# Altium schematic sheet MainBoard_MCU_Power.SchDoc
size B
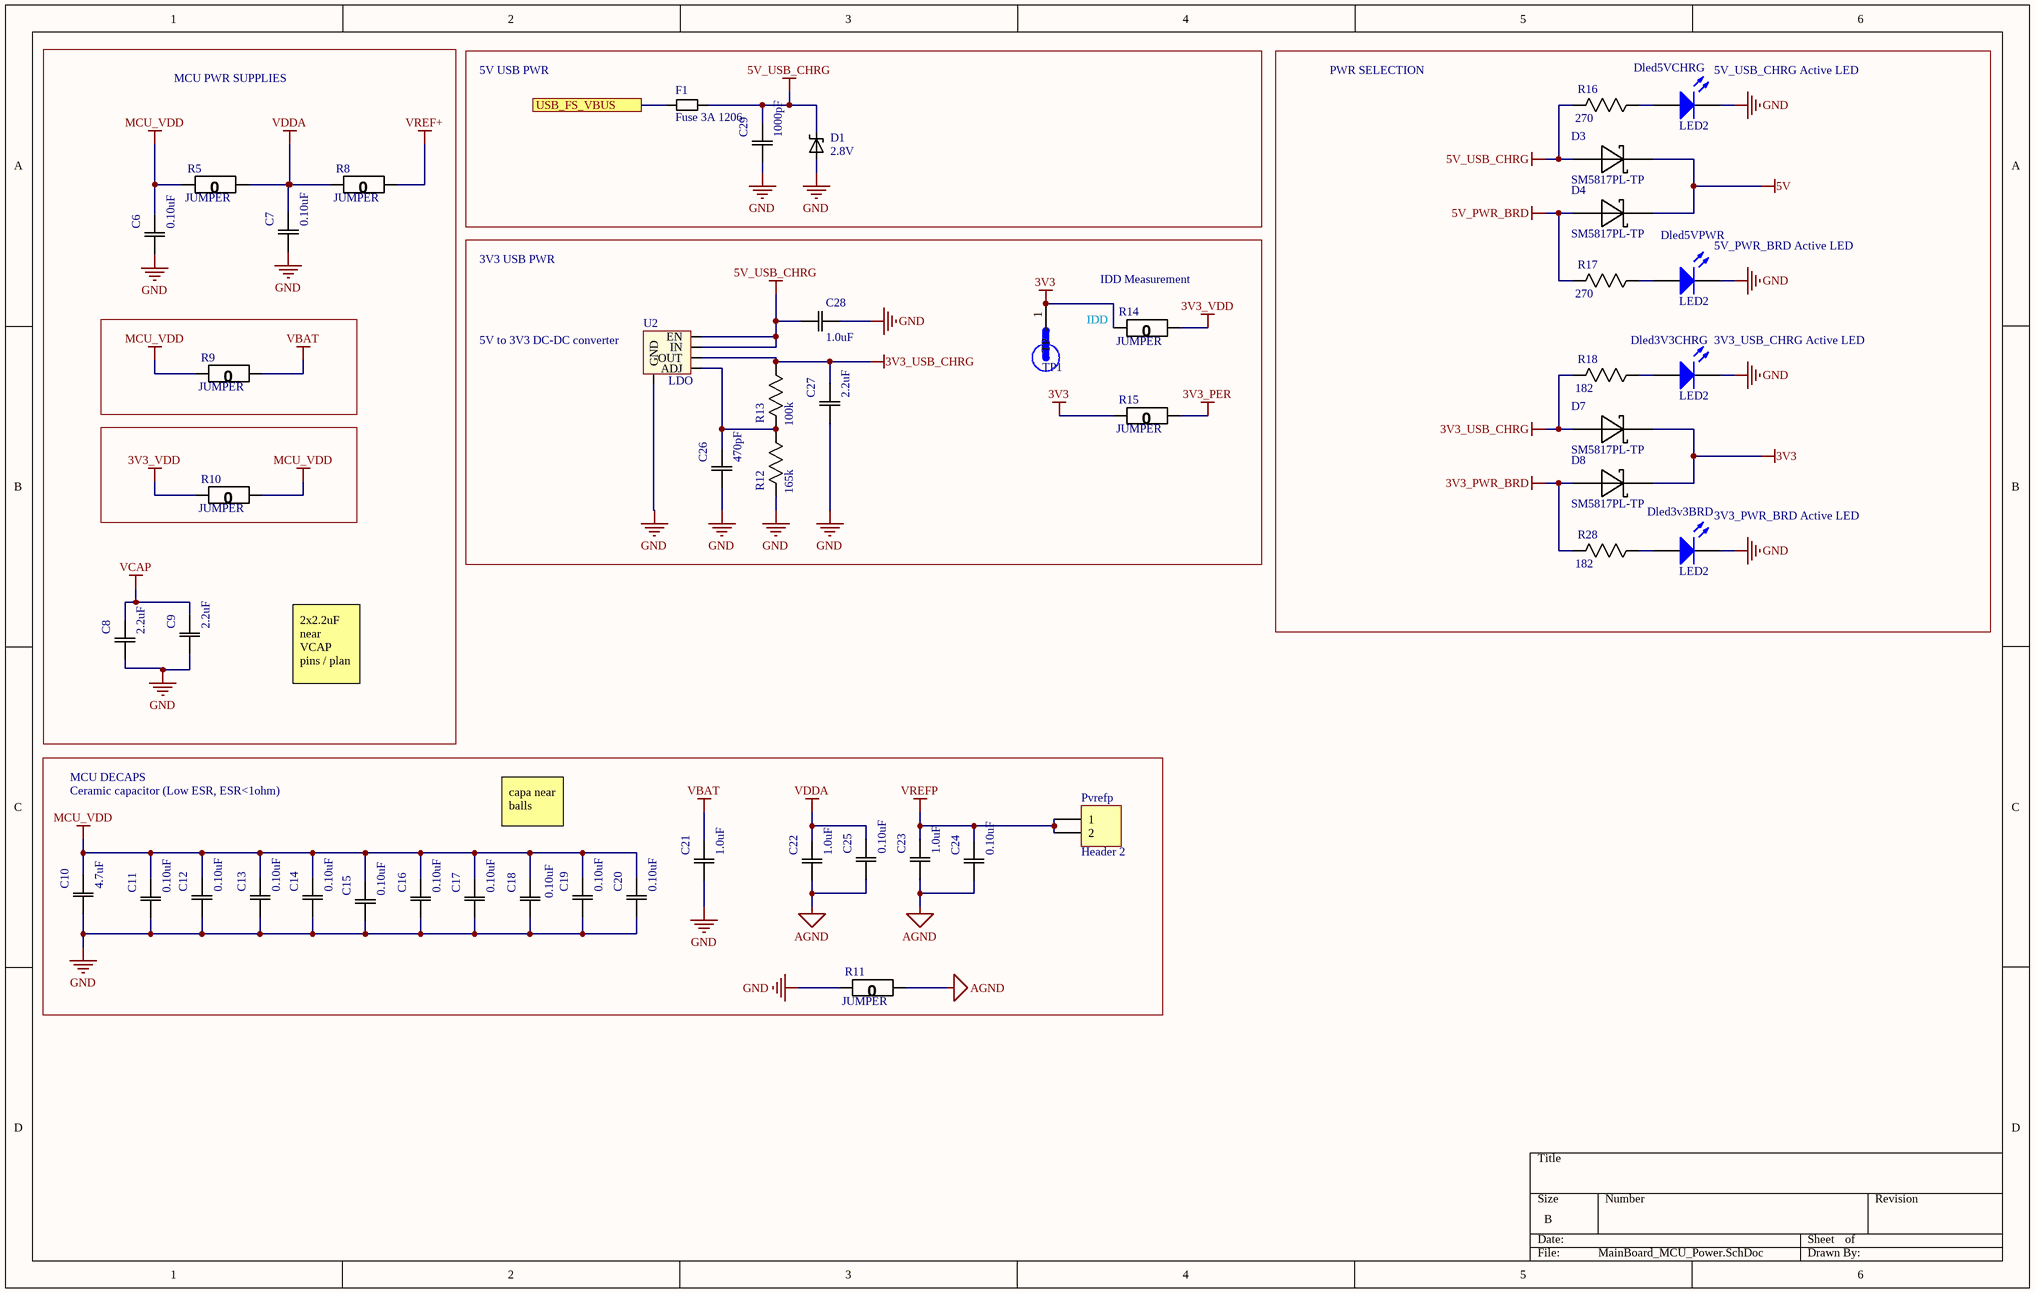
[diagram p0: MainBoard_MCU_Power.SchDoc]

## Parts
C6  0.10uF  [0603]
C7  0.10uF  [0603]
C8  2.2uF  [0603]
C9  2.2uF  [0603]
C10  4.7uF  [0603]
C11  0.10uF  [0603]
C12  0.10uF  [0603]
C13  0.10uF  [0603]
C14  0.10uF  [0603]
C15  0.10uF  [0603]
C16  0.10uF  [0603]
C17  0.10uF  [0603]
C18  0.10uF  [0603]
C19  0.10uF  [0603]
C20  0.10uF  [0603]
C21  1.0uF  [0603]
C22  1.0uF  [0603]
C23  1.0uF  [0603]
C24  0.10uF  [0603]
C25  0.10uF  [0603]
C26  470pF  [0603]
C27  2.2uF  [0603]
C28  1.0uF  [0603]
C29  1000pF  [0603]
D1  2.8V  [SOD-123]
D3  SM5817PL-TP  [SOD-123]
D4  SM5817PL-TP  [SOD-123]
D7  SM5817PL-TP  [SOD-123]
D8  SM5817PL-TP  [SOD-123]
Dled3v3BRD  LED2  [3.2X1.6X1.1]
Dled3V3CHRG  LED2  [3.2X1.6X1.1]
Dled5VCHRG  LED2  [3.2X1.6X1.1]
Dled5VPWR  LED2  [3.2X1.6X1.1]
F1  Fuse 3A 1206  [1206]
Pvrefp  Header 2  [HDR1X2]
R5  JUMPER  [0805]
R8  JUMPER  [0805]
R9  JUMPER  [0805]
R10  JUMPER  [0805]
R11  JUMPER  [0805]
R12  165k  [0805]
R13  100k  [0805]
R14  JUMPER  [0805]
R15  JUMPER  [0805]
R16  270  [0805]
R17  270  [0805]
R18  182  [0805]
R28  182  [0805]
TP1  Test Point - 5019  [TP380X203]  (value not drawn)
U2  LDO  [REG LIN POS ADJ 500MA 8SOIC]

## Blocks framed on the sheet
MCU PWR SUPPLIES: C6-C9 R5 R8-R10
5V USB PWR: C29 D1 F1

## Ports
USB_FS_VBUS

## Nets
3V3: D7.C(K) D8.C(K) R14.2(R2) R15.2(R2) TP1.1(TP)
3V3_PER: R15.1(R1)
3V3_PWR_BRD: D8.A R28.2(R2)
3V3_USB_CHRG: C27.2(C2) D7.A R13.1(R1) R18.2(R2) U2.OUT
3V3_VDD: R10.2(R2) R14.1(R1)
5V: D3.C(K) D4.C(K)
5V_PWR_BRD: D4.A R17.2(R2)
5V_USB_CHRG: C28.1(C1) C29.2(C2) D1.C D3.A F1.2 R16.2(R2) U2.EN U2.IN
AGND: C22.1(C1) C23.1(C1) C24.1(C1) C25.1(C1) R11.1(R1)
GND: C6.1(C1) C7.1(C1) C8.1(C1) C9.1(C1) C10.1(C1) C11.1(C1) C12.1(C1) C13.1(C1) C14.1(C1) C15.1(C1) C16.1(C1) C17.1(C1) C18.1(C1) C19.1(C1) C20.1(C1) C21.1(C1) C26.1(C1) C27.1(C1) C28.2(C2) C29.1(C1) D1.A Dled3v3BRD.2(K) Dled3V3CHRG.2(K) Dled5VCHRG.2(K) Dled5VPWR.2(K) R11.2(R2) R12.2(R2) U2.GND
MCU_VDD: C6.2(C2) C10.2(C2) C11.2(C2) C12.2(C2) C13.2(C2) C14.2(C2) C15.2(C2) C16.2(C2) C17.2(C2) C18.2(C2) C19.2(C2) C20.2(C2) R5.2(R2) R9.2(R2) R10.1(R1)
VBAT: C21.2(C2) R9.1(R1)
VCAP: C8.2(C2) C9.2(C2)
VDDA: C7.2(C2) C22.2(C2) C25.2(C2) R5.1(R1) R8.2(R2)
VREF+: R8.1(R1)
VREFP: C23.2(C2) C24.2(C2) Pvrefp.1 Pvrefp.2
USB_FS_VBUS: F1.1 ; port USB_FS_VBUS
NetC26_2: C26.2(C2) R12.1(R1) R13.2(R2) U2.ADJ
NetDled3v3BRD_1: Dled3v3BRD.1(A) R28.1(R1)
NetDled3V3CHRG_1: Dled3V3CHRG.1(A) R18.1(R1)
NetDled5VCHRG_1: Dled5VCHRG.1(A) R16.1(R1)
NetDled5VPWR_1: Dled5VPWR.1(A) R17.1(R1)

## Notes on the sheet
- PWR SELECTION
- (near Dled5VCHRG) 5V_USB_CHRG Active LED
- 3V3 USB PWR
- (near R14) IDD Measurement
- (near Dled5VPWR) 5V_PWR_BRD Active LED
- (near U2) 5V to 3V3 DC-DC converter
- (near R14) IDD
- (near Dled3V3CHRG) 3V3_USB_CHRG Active LED
- (near Dled3v3BRD) 3V3_PWR_BRD Active LED
- 2x2.2uF near VCAP pins / plan
- MCU DECAPS
- Ceramic capacitor (Low ESR, ESR<1ohm)
- capa near balls

## Library data of the parts
C6 C7 C11-C20 C24 C25 = CAP 0.10uF 16V: CAP CER 0.10UF 16V X5R 0603/0805; Tolerance: 10%; Package: 0603/0805; Value: 0.10uF; Rating: 16V; Temperature Coefficient: X5R; Operating Temperature: -55°C ~ 85°C
C8 C9 C27 = CAP 2.2uF 16V: CAP CER 2.2UF 16V X5R 0603/0805; Tolerance: 10%; Package: 0603/0805; Value: 2.2uF; Rating: 16V; Temperature Coefficient: X5R; Operating Temperature: -55°C ~ 85°C
C10 = CAP 4.7uF 16V: CAP CER 4.7UF 16V X5R 0603/0805; Tolerance: 10%; Package: 0603/0805; Value: 4.7uF; Rating: 16V; Temperature Coefficient: X5R; Operating Temperature: -55°C ~ 85°C
C21-C23 C28 = CAP 1.0uF 16V: CAP CER 1.0UF 16V X5R 0603/0805; Tolerance: 10%; Package: 0603/0805; Value: 1.0uF; Rating: 16V; Temperature Coefficient: X5R; Operating Temperature: -55°C ~ 85°C
C26 = CAP 470pF 16V: CAP CER 470PF 16V X5R 0603/0805; Tolerance: 10%; Package: 0603/0805; Value: 470pF; Rating: 16V; Temperature Coefficient: X5R; Operating Temperature: -55°C ~ 85°C
C29 = CAP 1000pF 16V: CAP CER 1000PF 16V X5R 0603/0805; Tolerance: 10%; Package: 0603/0805; Value: 1000pF; Rating: 16V; Temperature Coefficient: X5R; Operating Temperature: -55°C ~ 85°C
D1 = DIODE ZENER 2.8V 500mW: Zener Diode 2.8V 500mW ±5% Surface Mount SOD-123; Impedance (Max) (Zzt): 30 Ohms; Current - Reverse Leakage @ Vr: 75µA @ 1V; Voltage - Forward (Vf) (Max) @ If: 900mV @ 10mA; ComponentLink1Description: digikey; ComponentLink1URL: https://www.digikey.ca/en/products/detail/micro-commercial-co/MMSZ5245B-TP/1793206; Power - Max: 500mW; Voltage - Zener (Nom) (Vz): 2.8V
D3 D4 D7 D8 = DIODE SCHOTTKY 20V 1A: Diode Schottky 20V 1A Surface Mount SOD-123FL; MF: Micro Commercial Co; ComponentLink1Description: digikey; ComponentLink1URL: https://www.digikey.ca/product-detail/en/on-semiconductor/MBR0540T1G/MBR0540T1GOSCT-ND/917967; Digikey: SM5817PL-TPMSCT-ND; Digikey Link: https://www.digikey.ca/product-detail/en/micro-commercial-co/SM5817PL-TP/SM5817PL-TPMSCT-ND/1793410; MP: SM5817PL-TP; Voltage Rating: 20V; Package: SOD-123; Current Rating: 1A
Dled3v3BRD Dled3V3CHRG Dled5VCHRG Dled5VPWR = LED GREEN SMD: Typical RED, GREEN, YELLOW, AMBER GaAs LED; Voltage - Forward (Vf) (Typ): 2V; Lens Transparency: Clear; Current - Test: 20mA; Package: 1206; Color: Green
F1 = FUSE 3A 63V SLOW: FUSE 3A 63V AC/DC SLOW 1206; Response Time: Slow Blow; Current Rating (Amps): 3A; Operating Temperature: -55°C ~ 90°C; Voltage Rating - AC: 63V; Voltage Rating - DC: 63V
Pvrefp = Header 2: Header, 2-Pin; LatestRevisionDate: 17-Jul-2002; LatestRevisionNote: Re-released for DXP Platform.; Publisher: Altium Limited
R5 R8-R11 R14 R15 = RES 0 JUMPER: RES SMD 0 OHM JUMPER GENERIC 0805; Value: 0; Package: 0805
R12 = RES 165k 1/4W: RES SMD 165K OHM 1% 1/4W 0805; Power (Watts): 0.25W; Package: 0805; Value: 165k; Tolerance: 1%
R13 = RES 100k 1/8W - 1%: RES SMD 100K OHM 1% 1/8W 0805; Power (Watts): 0.125W; Package: 0805; Value: 100k; Tolerance: 1%
R16 R17 = RES 270.0 1/8W: RES SMD 270 OHM 5% 1/8W 0805; Power (Watts): 0.125W; Package: 0805; Value: 270; Tolerance: 5%
R18 R28 = RES 182.0 1/8W: RES SMD 182 OHM 1% 1/8W 0805; Power (Watts): 0.125W; Package: 0805; Value: 182; Tolerance: 1%
TP1 = Test Point - 5019: PC Test Point, Miniature Phosphor Bronze, Silver Plating Surface Mount Mounting Type; MP: 5019; MF: Keystone Electronics; Value: *; Package: 2010 Keystone; Digi-Key_Part_Number: 36-5019CT-ND; Digi-Key_Purchase_URL: https://www.digikey.com/product-detail/en/keystone-electronics/5019/36-5019CT-ND/3907344?utm_source=snapeda&utm_medium=aggregator&utm_campaign=symbol
U2 = REG LIN POS ADJ: Linear Voltage Regulator IC  1 Output  500mA 8-SOIC; MF: Texas Instruments; MP: TL5209DR; Digikey: 296-21569-1-ND; Digikey Link: https://www.digikey.ca/product-detail/en/texas-instruments/TL5209DR/296-21569-1-ND/1427137; Price: 1.548 CAD; Rating: 500mA; Package: 8 SOIC; Supplier 1: Digi-Key; Supplier Part Number 1: 296-21569-1-ND